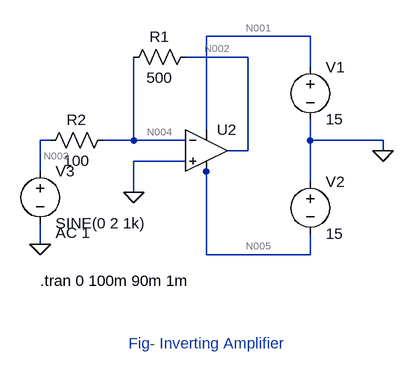
[diagram p0: schematic Inverting Amplifier.asc]
Inverting Amplifier.asc, the LTspice schematic file:
Version 4
SHEET 1 880 680
WIRE 416 112 256 112
WIRE 320 144 224 144
WIRE 416 160 416 112
WIRE 256 256 256 112
WIRE 16 272 0 272
WIRE 144 272 144 144
WIRE 144 272 96 272
WIRE 224 272 144 272
WIRE 416 272 416 240
WIRE 528 272 416 272
WIRE 320 288 320 144
WIRE 320 288 288 288
WIRE 528 288 528 272
WIRE 224 304 144 304
WIRE 0 320 0 272
WIRE 256 320 256 304
WIRE 416 336 416 272
WIRE 144 352 144 304
WIRE 0 432 0 400
WIRE 256 448 256 320
WIRE 416 448 416 416
WIRE 416 448 256 448
FLAG 528 288 0
FLAG 144 352 0
FLAG 0 432 0
SYMBOL voltage 416 144 R0
SYMATTR InstName V1
SYMATTR Value 15
SYMBOL voltage 416 320 R0
SYMATTR InstName V2
SYMATTR Value 15
SYMBOL voltage 0 304 R0
WINDOW 123 24 110 Left 2
WINDOW 39 0 0 Left 0
SYMATTR InstName V3
SYMATTR Value SINE(0 2 1k)
SYMATTR Value2 AC 1
SYMBOL res 240 128 R90
WINDOW 0 0 56 VBottom 2
WINDOW 3 32 56 VTop 2
SYMATTR InstName R1
SYMATTR Value 500
SYMBOL res 112 256 R90
WINDOW 0 0 56 VBottom 2
WINDOW 3 32 56 VTop 2
SYMATTR InstName R2
SYMATTR Value 100
SYMBOL OpAmps\\UniversalOpAmp 256 288 R0
SYMATTR InstName U2
TEXT 0 488 Left 2 !.tran 0 100m 90m 1m
TEXT 136 584 Left 2 ;Fig- Inverting Amplifier

The netlist it stands for:
* Inverting Amplifier.asc
V1 N001 0 15
V2 0 N005 15
V3 N003 0 SINE(0 2 1k) AC 1
R1 N002 N004 500
R2 N004 N003 100
XU2 0 N004 N001 N005 N002 level1 Avol=1Meg GBW=10Meg Vos=0 En=0 Enk=0 In=0 Ink=0 Rin=500Meg  ; pins In+ In- V+ V- OUT
.tran 0 100m 90m 1m
* Fig- Inverting Amplifier
.lib UniversalOpAmp1.lib
.backanno
.end

* Results of the author's LTspice run, read from the files saved beside the schematic
* Operating Point, zero values left out:
*   V(n001) = 15 V
*   V(n005) = -15 V
*   I(V1) = -30 nA
*   I(V2) = -30 nA
*   Ix(u2:3) = 30 nA
*   Ix(u2:4) = -30 nA
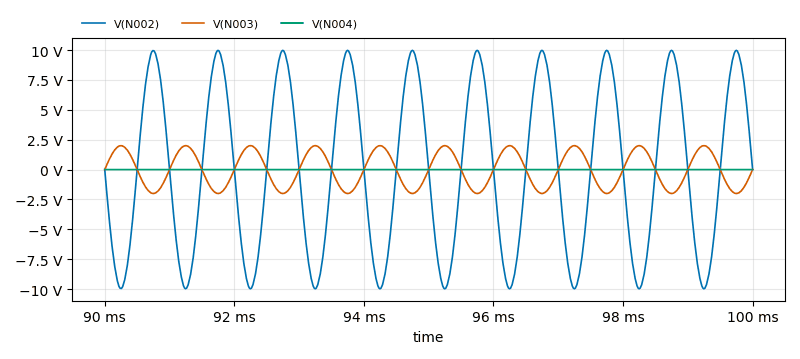
[diagram p1: Transient Analysis of Inverting Amplifier.asc, plotted from the saved traces]
* Transient Analysis, 1 run:
*   V(N002): min -9.975 V, max 9.975 V, average -117.2 µV, rms 7.004 V, last 5.976 mV
*   V(N003): min -2 V, max 2 V, average 9.743 µV, rms 1.416 V, last 0 V
*   V(N004): min -988.5 µV, max 996 µV, average 36.46 nV, rms 698.9 µV, last 996 µV